# Altium schematic sheet ALPS0.1.SchDoc
size A4
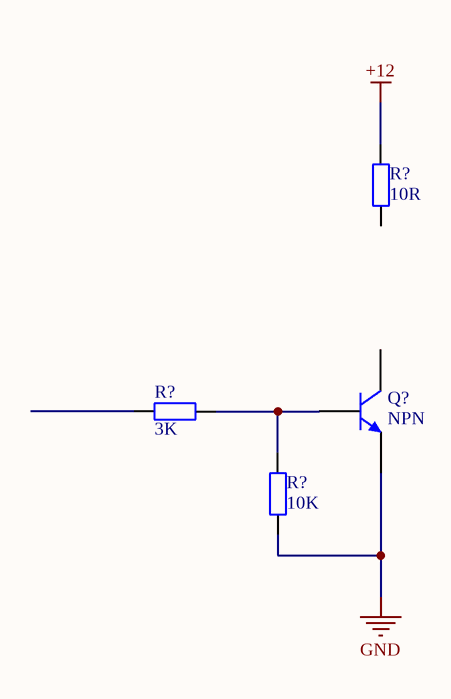
[diagram p0: ALPS0.1.SchDoc]

## Parts
(Parts that share a designator on the sheet are numbered #1, #2 ... from top to bottom, then left to right.)
Q?  NPN  [SOT23]
R?#1  10R  [0805_L]
R?#2  3K  [0805_L]
R?#3  10K  [0805_L]

## Nets
+12: R?#1.2
GND: Q?.2(E) R?#3.1
NetQ?_1: Q?.1(B) R?#2.2 R?#3.2

Not connected (* = marked no-connect by the designer): Q? 3(C); R?#1 1; R?#2 1

## Library data of the parts
R?#1-R?#3 = 0805 4.7KΩ (4701) 1%: 贴片电阻; ComponentLink1Description: 供应商链接; ComponentLink1URL: http://www.szlcsc.com/product/details_18361.html; Package: 0805; Supplier: LC; SuppliersPartNumber: C17673
Q? = NPN: Published: 8-Jun-2000; LatestRevisionDate: 17-Jul-2002; LatestRevisionNote: Re-released for DXP Platform.; PackageReference: TO-226-AA; Publisher: Altium Limited; PackageDescription: TO, Flat Index; 3 In-Line, Axial Leads; Body Dia. 4.8mm; Leads 0.55 x 0.51 mm (max); Code_JEDEC: TO-226-AA